# EAGLE design triversity (EAGLE 6.6.0)
Triversity Multipath Erazer
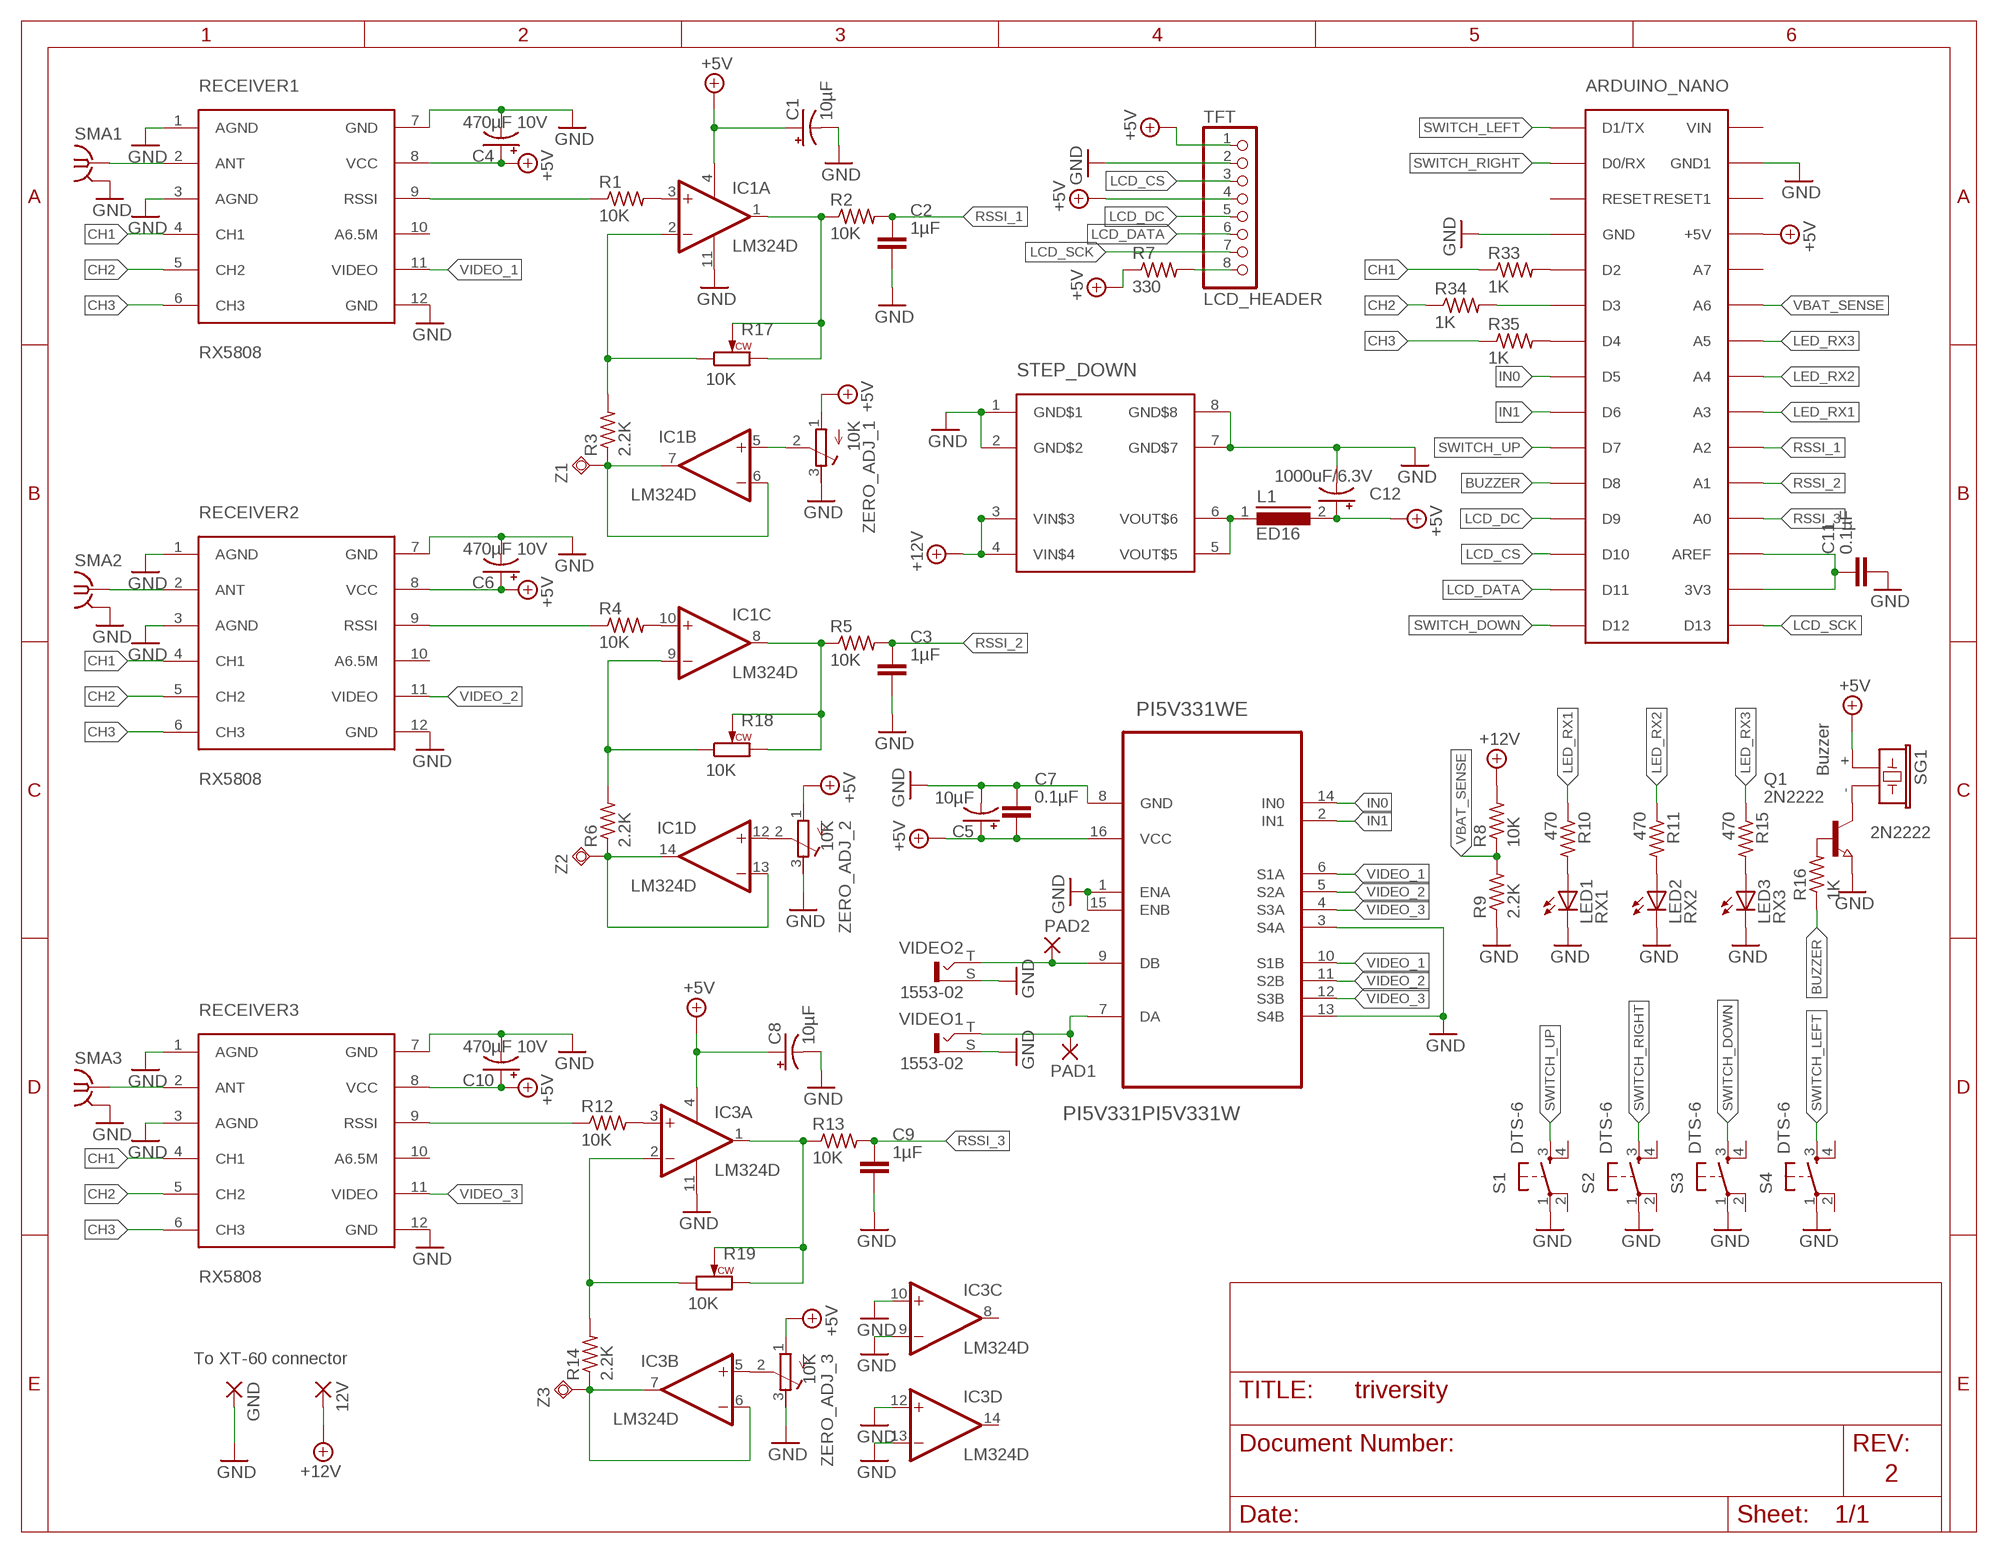
[diagram p0: schematic, sheet 1]

## Parts
12V  WIREPAD4,16O1,6  [4,16O1,6]
ARDUINO_NANO  ARDUINO_NANO  [PDIP-32]
C1  10µF  CAP_POL1206-KIT  [EIA3216-KIT]
C2  1µF  CAPACITOR_NPOL-0805  [C805]
C3  1µF  CAPACITOR_NPOL-0805  [C805]
C4  470µF 10V  CAP_POL7343  [EIA7343]
C5  10µF  CAP_POL1206-KIT  [EIA3216-KIT]
C6  470µF 10V  CAP_POL7343  [EIA7343]
C7  0.1µF  CAPACITOR_NPOL-0805  [C805]
C8  10µF  CAP_POL1206-KIT  [EIA3216-KIT]
C9  1µF  CAPACITOR_NPOL-0805  [C805]
C10  470µF 10V  CAP_POL7343  [EIA7343]
C11  0.1µF  CAPACITOR_NPOL-0805  [C805]
C12  1000uF/6.3V  CPOL-USE5-10.5  [E5-10,5]
GND  WIREPAD4,16O1,6  [4,16O1,6]
IC1  LM324D  [SO14]
IC3  LM324D  [SO14]
L1  ED16  [ED16]
LED1  RX1  LED3MM  [LED3MM]
LED2  RX2  LED3MM  [LED3MM]
LED3  RX3  LED3MM  [LED3MM]
PAD1  WIREPADSMD1,27-254  [SMD1,27-2,54]
PAD2  WIREPADSMD1,27-254  [SMD1,27-2,54]
PI5V331WE  PI5V331PI5V331W  [SO16]
Q1  2N2222  NPN-TRANSISTOR_SOT23  [SOT23]
R1  10K  R-US_M0805  [M0805]
R2  10K  R-US_M0805  [M0805]
R3  2.2K  R-US_M0805  [M0805]
R4  10K  R-US_M0805  [M0805]
R5  10K  R-US_M0805  [M0805]
R6  2.2K  R-US_M0805  [M0805]
R7  330  R-US_M0805  [M0805]
R8  10K  R-US_M0805  [M0805]
R9  2.2K  R-US_M0805  [M0805]
R10  470  R-US_M0805  [M0805]
R11  470  R-US_M0805  [M0805]
R12  10K  R-US_M0805  [M0805]
R13  10K  R-US_M0805  [M0805]
R14  2.2K  R-US_M0805  [M0805]
R15  470  R-US_M0805  [M0805]
R16  1K  R-US_M0805  [M0805]
R17  10K  POT-SINGLE-RK09L  [RK09L-SINGLE]
R18  10K  POT-SINGLE-RK09L  [RK09L-SINGLE]
R19  10K  POT-SINGLE-RK09L  [RK09L-SINGLE]
R33  1K  R-US_M0805  [M0805]
R34  1K  R-US_M0805  [M0805]
R35  1K  R-US_M0805  [M0805]
RECEIVER1  RX5808  RX5808V1  [RX5808]
RECEIVER2  RX5808  RX5808V1  [RX5808]
RECEIVER3  RX5808  RX5808V1  [RX5808]
S1  DTS-6  [DTS-6]
S2  DTS-6  [DTS-6]
S3  DTS-6  [DTS-6]
S4  DTS-6  [DTS-6]
SG1  Buzzer  F/CM12P  [F/CM12P]
SMA1  SMA-142-0711-821/826  [J502-ND-142-0711-821/826]
SMA2  SMA-142-0711-821/826  [J502-ND-142-0711-821/826]
SMA3  SMA-142-0711-821/826  [J502-ND-142-0711-821/826]
STEP_DOWN  LM2596_MODULE  [LM2596-MODULE]
TFT  LCD_HEADER  PINHD-1X8CLEANBIG  [1X08-CLEANBIG]
VIDEO1  1553-02  [1553-02]
VIDEO2  1553-02  [1553-02]
Z1  TP-M  [KEY-MINIATURE]
Z2  TP-M  [KEY-MINIATURE]
Z3  TP-M  [KEY-MINIATURE]
ZERO_ADJ_1  10K  R-TRIMM3296X  [RTRIM3296X]
ZERO_ADJ_2  10K  R-TRIMM3296X  [RTRIM3296X]
ZERO_ADJ_3  10K  R-TRIMM3296X  [RTRIM3296X]

## Nets
3V3_AREF: ARDUINO_NANO.3V3 ARDUINO_NANO.AREF C11.1
+5V: ARDUINO_NANO.+5V C1.A(+) C4.A(+) C5.A(+) C6.A(+) C7.2 C8.A(+) C10.A(+) C12.+ IC1.4(P:V+) IC3.4(P:V+) L1.2 PI5V331WE.16(VCC) R7.1 RECEIVER1.8(VCC) RECEIVER2.8(VCC) RECEIVER3.8(VCC) SG1.+ TFT.1 TFT.4 ZERO_ADJ_1.1(E) ZERO_ADJ_2.1(E) ZERO_ADJ_3.1(E)
+12V: 12V.1(P) R8.2 STEP_DOWN.3(VIN$3) STEP_DOWN.4(VIN$4)
ANT1: RECEIVER1.2(ANT) SMA1.1
ANT2: RECEIVER2.2(ANT) SMA2.1
ANT3: RECEIVER3.2(ANT) SMA3.1
BUZZER: ARDUINO_NANO.D8 R16.1
CH1: R33.1 RECEIVER1.4(CH1) RECEIVER2.4(CH1) RECEIVER3.4(CH1)
CH2: R34.1 RECEIVER1.5(CH2) RECEIVER2.5(CH2) RECEIVER3.5(CH2)
CH3: R35.1 RECEIVER1.6(CH3) RECEIVER2.6(CH3) RECEIVER3.6(CH3)
GND: ARDUINO_NANO.GND ARDUINO_NANO.GND1 C1.C(-) C2.2 C3.2 C4.C(-) C5.C(-) C6.C(-) C7.1 C8.C(-) C9.2 C10.C(-) C11.2 C12.- GND.1(P) IC1.11(P:V-) IC3.9(C:-IN) IC3.10(C:+IN) IC3.11(P:V-) IC3.12(D:+IN) IC3.13(D:-IN) LED1.K(C) LED2.K(C) LED3.K(C) PI5V331WE.1(ENA) PI5V331WE.3(S4A) PI5V331WE.8(GND) PI5V331WE.13(S4B) PI5V331WE.15(ENB) Q1.2(E) R9.1 RECEIVER1.1(AGND) RECEIVER1.3(AGND) RECEIVER1.7(GND) RECEIVER1.12(GND) RECEIVER2.1(AGND) RECEIVER2.3(AGND) RECEIVER2.7(GND) RECEIVER2.12(GND) RECEIVER3.1(AGND) RECEIVER3.3(AGND) RECEIVER3.7(GND) RECEIVER3.12(GND) S1.1 S2.1 S3.1 S4.1 SMA1.G@1(GND) SMA2.G@1(GND) SMA3.G@1(GND) STEP_DOWN.1(GND$1) STEP_DOWN.2(GND$2) STEP_DOWN.7(GND$7) STEP_DOWN.8(GND$8) TFT.2 VIDEO1.S VIDEO2.S ZERO_ADJ_1.3(A) ZERO_ADJ_2.3(A) ZERO_ADJ_3.3(A)
IN0: ARDUINO_NANO.D5 PI5V331WE.14(IN0)
IN1: ARDUINO_NANO.D6 PI5V331WE.2(IN1)
LCD_CS: ARDUINO_NANO.D10 TFT.3
LCD_DATA: ARDUINO_NANO.D11 TFT.6
LCD_DC: ARDUINO_NANO.D9 TFT.5
LCD_SCK: ARDUINO_NANO.D13 TFT.7
LED_RX1: ARDUINO_NANO.A3 R10.1
LED_RX2: ARDUINO_NANO.A4 R11.1
LED_RX3: ARDUINO_NANO.A5 R15.1
N$1: IC1.3(A:+IN) R1.2
N$2: IC3.3(A:+IN) R12.2
N$3: IC1.1(A:OUT) R2.1 R17.2(W) R17.3(CW)
N$4: R7.2 TFT.8
N$5: IC1.6(B:-IN) IC1.7(B:OUT) R3.1 Z1.P$1(TP)
N$6: IC1.2(A:-IN) R3.2 R17.1(CCW)
N$7: IC1.10(C:+IN) R4.2
N$8: IC1.5(B:+IN) ZERO_ADJ_1.2(S)
N$9: IC1.8(C:OUT) R5.1 R18.2(W) R18.3(CW)
N$10: IC1.13(D:-IN) IC1.14(D:OUT) R6.1 Z2.P$1(TP)
N$11: IC1.9(C:-IN) R6.2 R18.1(CCW)
N$12: IC1.12(D:+IN) ZERO_ADJ_2.2(S)
N$13: Q1.3(C) SG1.-
N$14: IC3.1(A:OUT) R13.1 R19.2(W) R19.3(CW)
N$15: IC3.6(B:-IN) IC3.7(B:OUT) R14.1 Z3.P$1(TP)
N$16: IC3.2(A:-IN) R14.2 R19.1(CCW)
N$17: IC3.5(B:+IN) ZERO_ADJ_3.2(S)
N$18: LED1.A R10.2
N$19: Q1.1(B) R16.2
N$21: L1.1 STEP_DOWN.5(VOUT$5) STEP_DOWN.6(VOUT$6)
N$48: LED2.A R11.2
N$49: LED3.A R15.2
N$50: ARDUINO_NANO.D2 R33.2
N$51: ARDUINO_NANO.D3 R34.2
N$53: ARDUINO_NANO.D4 R35.2
RAW_RSSI1: R1.1 RECEIVER1.9(RSSI)
RAW_RSSI2: R4.1 RECEIVER2.9(RSSI)
RAW_RSSI3: R12.1 RECEIVER3.9(RSSI)
RSSI_1: ARDUINO_NANO.A2 C2.1 R2.2
RSSI_2: ARDUINO_NANO.A1 C3.1 R5.2
RSSI_3: ARDUINO_NANO.A0 C9.1 R13.2
SWITCH_DOWN: ARDUINO_NANO.D12 S3.3
SWITCH_LEFT: ARDUINO_NANO.D1/TX S4.3
SWITCH_RIGHT: ARDUINO_NANO.D0/RX S2.3
SWITCH_UP: ARDUINO_NANO.D7 S1.3
VBAT_SENSE: ARDUINO_NANO.A6 R8.1 R9.2
VIDEO_1: PI5V331WE.6(S1A) PI5V331WE.10(S1B) RECEIVER1.11(VIDEO)
VIDEO_2: PI5V331WE.5(S2A) PI5V331WE.11(S2B) RECEIVER2.11(VIDEO)
VIDEO_3: PI5V331WE.4(S3A) PI5V331WE.12(S3B) RECEIVER3.11(VIDEO)
VIDEO_OUT1: PAD1.1(P) PI5V331WE.7(DA) VIDEO1.T
VIDEO_OUT2: PAD2.1(P) PI5V331WE.9(DB) VIDEO2.T
Unconnected: ARDUINO_NANO.A7 ARDUINO_NANO.RESET ARDUINO_NANO.RESET1 ARDUINO_NANO.VIN IC3.8(C:OUT) IC3.14(D:OUT) RECEIVER1.10(A6.5M) RECEIVER2.10(A6.5M) RECEIVER3.10(A6.5M) S1.2 S1.4 S2.2 S2.4 S3.2 S3.4 S4.2 S4.4

## Notes on the sheet
- 2N2222
- To XT-60 connector
- 2

## Power pins joined to a net without a drawn wire
GND: SMA1.G@2(GND) SMA1.G@3(GND) SMA1.G@4(GND) SMA2.G@2(GND) SMA2.G@3(GND) SMA2.G@4(GND) SMA3.G@2(GND) SMA3.G@3(GND) SMA3.G@4(GND)

## Library data of the parts
12V GND PAD1 PAD2 = wirepad:WIREPAD: Wire PAD connect wire on PCB
ARDUINO_NANO = goebish:ARDUINO_NANO
C1 C4-C6 C8 C10 = SparkFun-Passives:CAP_POL: Capacitor Polarized These are standard SMD and PTH capacitors. Normally 10uF, 47uF, and 100uF in electrolytic and tantalum varieties. Always verify the external diameter of the through hole cap, it varies with capacity, voltage, and manufacturer. The EIA devices should be standard.
C2 C3 C7 C9 C11 = dangerous_prototype_devices:CAPACITOR_NPOL: Non-Polarized capacitor in various packages
C12 = adafruit:CPOL-US: POLARIZED CAPACITOR, American symbol
IC1 IC3 = linear:LM324: OP AMP
L1 = inductors:ED16: INDUCTOR
LED1-LED3 = adafruit:LED: LED OSRAM: - CHIPLED LG R971, LG N971, LY N971, LG Q971, LY Q971, LO R971, LY R971 LH N974, LH R974 LS Q976, LO Q976, LY Q976 LO Q996 - Hyper CHIPLED LW Q18S LB Q993, LB Q99A, LB R99A - SideLED LS A670, LO A670, LY A670, LG A670, LP A670 LB A673, LV A673, LT A673, LW A673 LH A674 LY A675 LS A676, LA A676, LO A676, LY A676, LW A676 LS A679, LY A679, LG A679 - Hyper Micro SIDELED® LS Y876, LA Y876, LO Y876, LY Y876 LT Y87S - SmartLED LW L88C, LW L88S LB L89C, LB L89S, LG L890 LS L89K, LO L89K, LY L89K LS L896, LA L896, LO L896, LY L896 - TOPLED LS T670, LO T670, LY T670, LG T670, LP T670 LSG T670, LSP T670, LSY T670, LOP T670, LYG T670 LG T671, LOG T671, LSG T671 LB T673, LV T673, LT T673, LW T673 LH T674 LS T676, LA T676, LO T676, LY T676, LB T676, LH T676, LSB T676, LW T676 LB T67C, LV T67C, LT T67C, LS T67K, LO T67K, LY T67K, LW E67C LS E67B, LA E67B, LO E67B, LY E67B, LB E67C, LV E67C, LT E67C LW T67C LS T679, LY T679, LG T679 LS T770, LO T770, LY T770, LG T770, LP T770 LB T773, LV T773, LT T773, LW T773 LH T774 LS E675, LA E675, LY E675, LS T675 LS T776, LA T776, LO T776, LY T776, LB T776 LHGB T686 LT T68C, LB T68C - Hyper Mini TOPLED® LB M676 - Mini TOPLED Santana® LG M470 LS M47K, LO M47K, LY M47K Source: http://www.osram.convergy.de/
PI5V331WE = goebish:PI5V331: Bidirectional Dual 4-Channel multiplexer/demultiplexer
Q1 = semicon-smd-ipc:NPN-TRANSISTOR_: NPN TRANSISTOR
R1-R16 R33-R35 = adafruit:R-US_: RESISTOR, American symbol
R17-R19 = f-potentiometers:POT-SINGLE
RECEIVER1-RECEIVER3 = receiver:RX5808
S1-S4 = switch-tact:DTS-6
SG1 = buzzer:F/CM12P: BUZZER Source: Buerklin; OC_FARNELL: unknown; OC_NEWARK: unknown
SMA1-SMA3 = goebish:SMA-: SMA 50 Ohm End Launch Jack Receptacle - Round Contact Johnson Components Source: www.johnsoncomponents.com .. J502-ND.pdf
STEP_DOWN = goebish:LM2596_MODULE: Mini DC-DC Converter Step Down Module 3A
TFT = adafruit:PINHD-1X8: PIN HEADER
VIDEO1 VIDEO2 = goebish:1553-02: RCA connectors Lumberg 1553-02 Cinch RCA-Einbaukupplung nach JEITA RC-5231, abgewinkelte Ausführung Source: http://www.lumberg.com/Produkte/PDFs/1553_02.pdf; MPN: 1553-02; OC_FARNELL: 1200146; OC_NEWARK: 98K2588
Z1-Z3 = smt-test-points:TP-: Surface mount wire loop test point
ZERO_ADJ_1-ZERO_ADJ_3 = resistor:R-TRIMM: Trimm resistor

## Net classes
0 default: width 0.254 mm, drill 0.33 mm, clearance 0.203 mm

## Board
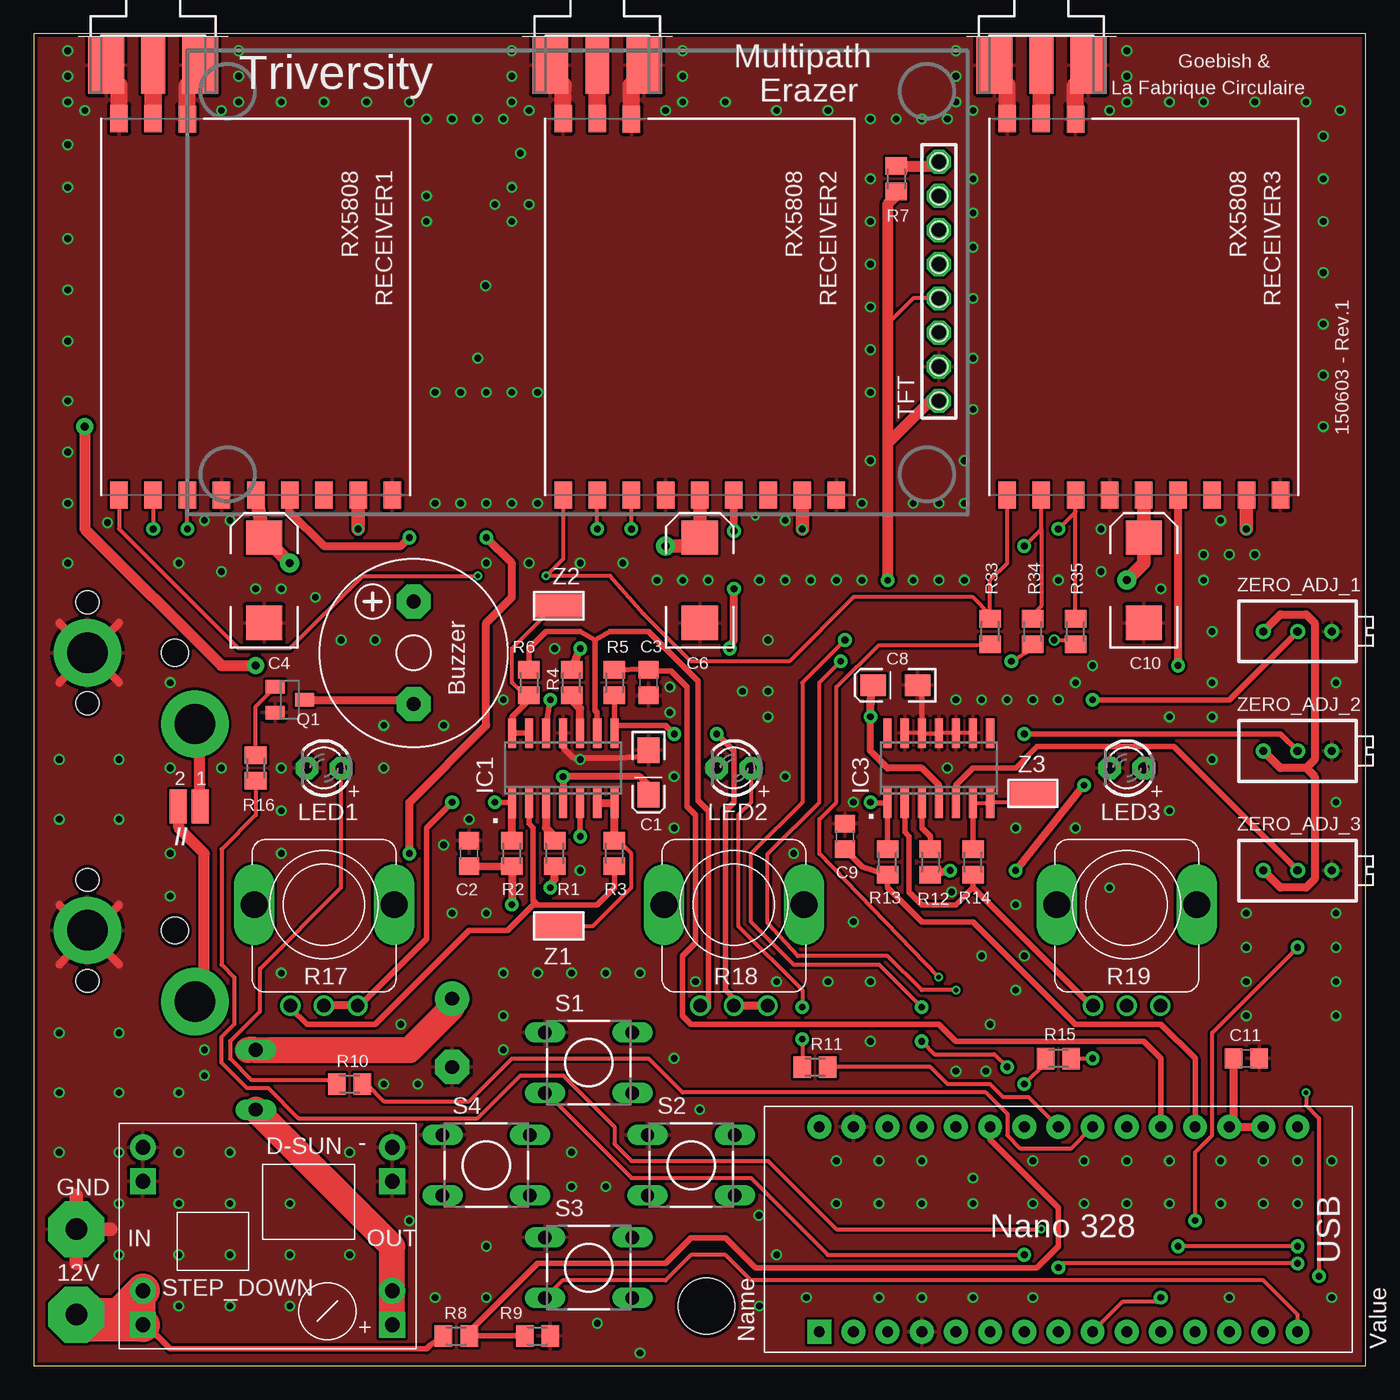
[diagram p1: board, top side]
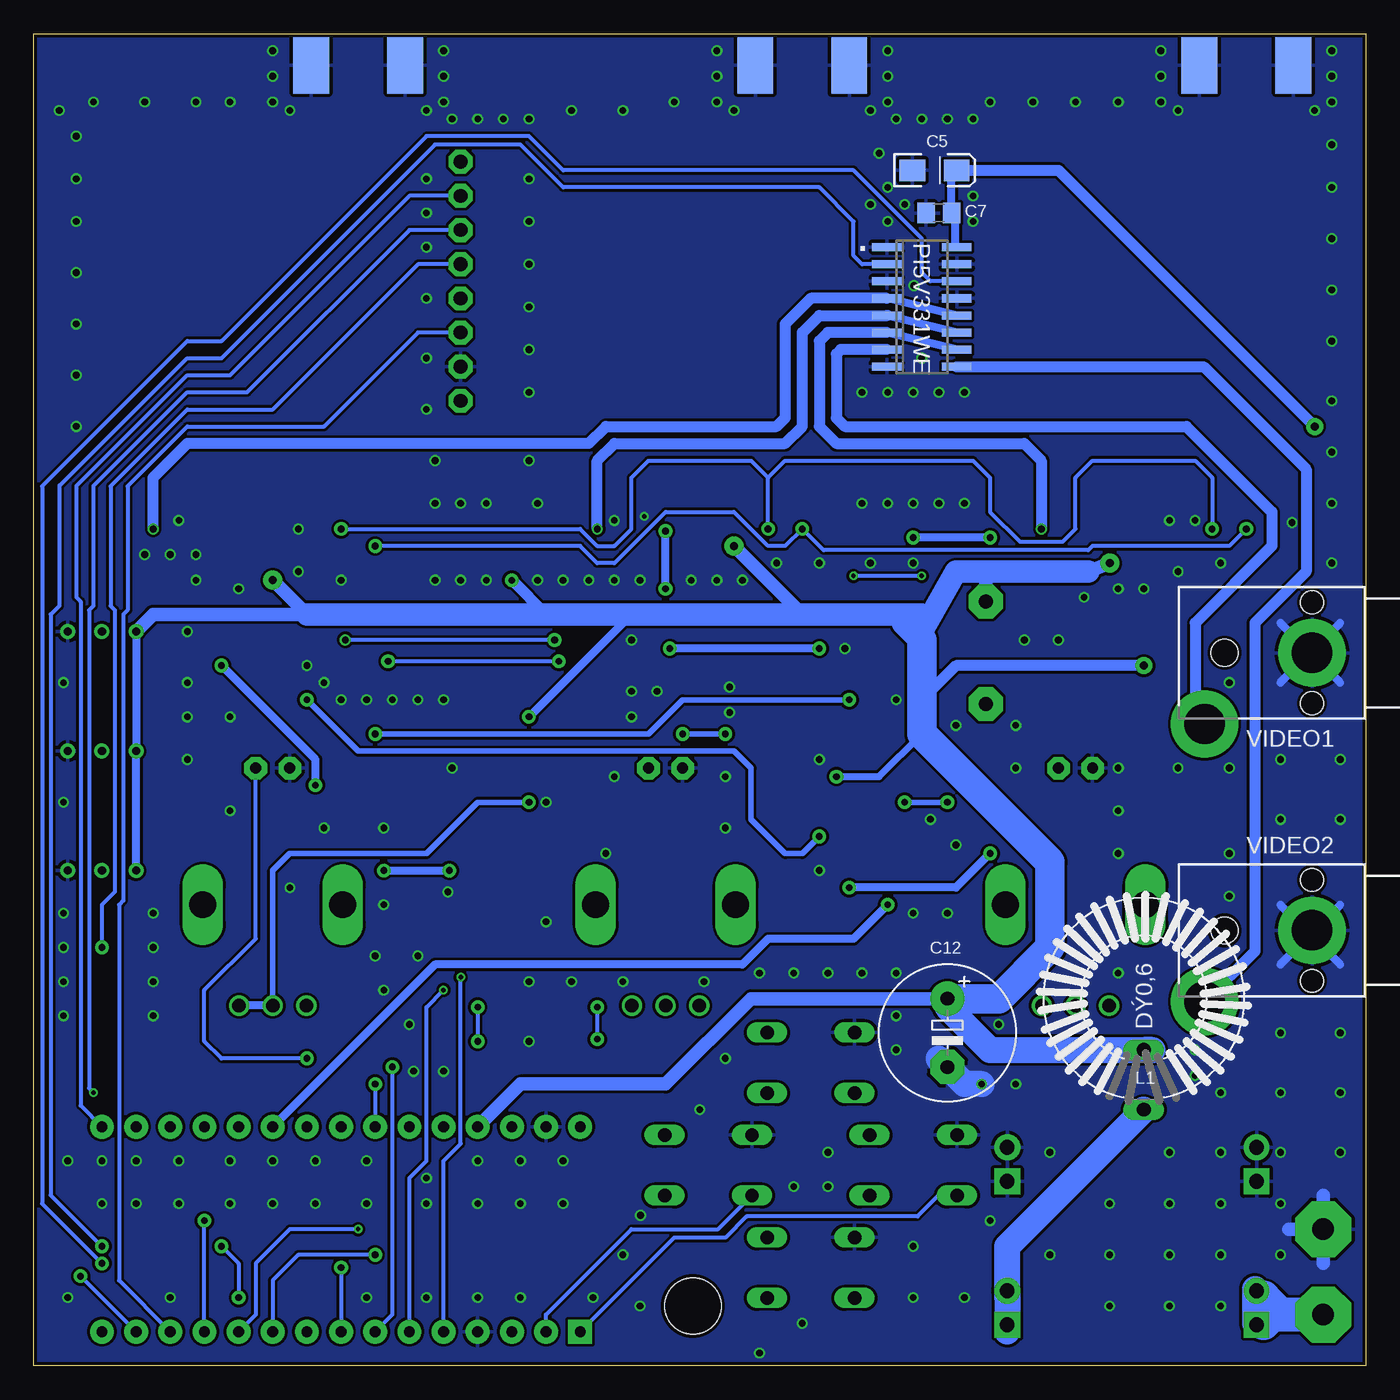
[diagram p2: board, bottom side, seen from below]

Size 99.06 x 99.06 mm. Coordinates in mm from the lower left corner, seen from the top.
Outline: 0,0 99.06,0 99.06,99.06 0,99.06 0,0
Copper layers (1*16): Top 0.035mm / dielectric 1.5mm / Bottom 0.035mm
Design rules "default": minimum track width 5mil, minimum drill 12mil, track to track 5mil, track to pad 5mil, pad to pad 5mil, via to via 5mil, smd to smd 0mil, copper to edge 10mil, drill to drill 10mil, minimum pad ring 10mil, minimum via ring 6mil, stop-mask expansion 2mil, vias tented up to drill 25mil, thermal gap 10mil
Holes 4.2 mm at 50.04,4.45

### Footprints (pad centres in the part's own frame; a part is rotated, then mirrored left to right if it is on the bottom)
4,16O1,6 = drill 1.6 pad 4.166 octagon: 1 0,0
PDIP-32 = drill 0.8 pad 1.778: 3V3 15.24,-35.56; +5V 15.24,-10.16; A0 15.24,-30.48; A1 15.24,-27.94; A2 15.24,-25.4; A3 15.24,-22.86; A4 15.24,-20.32; A5 15.24,-17.78; A6 15.24,-15.24; A7 15.24,-12.7; AREF 15.24,-33.02; D0/RX 0,-5.08; D2 0,-12.7; D3 0,-15.24; D4 0,-17.78; D5 0,-20.32; D6 0,-22.86; D7 0,-25.4; D8 0,-27.94; D9 0,-30.48; D10 0,-33.02; D11 0,-35.56; D12 0,-38.1; D13 15.24,-38.1; GND 0,-10.16; GND1 15.24,-5.08; RESET 0,-7.62; RESET1 15.24,-7.62; VIN 15.24,-2.54 | drill 0.8 pad 1.778 square: D1/TX 0,-2.54
EIA3216-KIT = smd 1.9 x 1.6: A 1.65,0; C -1.65,0
C805 = smd 1.3 x 1.5: 1 -0.95,0; 2 0.95,0
EIA7343 = smd 2.55 x 2.7: A 3.17,0; C -3.17,0
E5-10,5 = drill 1.016 pad 2.54: + -2.54,0 | drill 1.016 pad 2.54 octagon: - 2.54,0
SO14 = smd 0.6 x 2.2: 1 -3.81,-2.6; 2 -2.54,-2.6; 3 -1.27,-2.6; 4 0,-2.6; 5 1.27,-2.6; 6 2.54,-2.6; 7 3.81,-2.6; 8 3.81,2.6; 9 2.54,2.6; 10 1.27,2.6; 11 0,2.6; 12 -1.27,2.6; 13 -2.54,2.6; 14 -3.81,2.6
ED16 = drill 1.016 long: 1 -8.255,0; 2 -3.81,0
LED3MM = drill 0.813 pad 1.676 octagon: A -1.27,0; K 1.27,0
SMD1,27-2,54 = smd 1.27 x 2.54: 1 0,0
SO16 = smd 0.6 x 2.2: 1 -4.445,-2.6; 2 -3.175,-2.6; 3 -1.905,-2.6; 4 -0.635,-2.6; 5 0.635,-2.6; 6 1.905,-2.6; 7 3.175,-2.6; 8 4.445,-2.6; 9 4.445,2.6; 10 3.175,2.6; 11 1.905,2.6; 12 0.635,2.6; 13 -0.635,2.6; 14 -1.905,2.6; 15 -3.175,2.6; 16 -4.445,2.6
SOT23 = smd 1 x 1.4: 1 -0.95,-1.1; 2 0.95,-1.1; 3 0,1.1
M0805 = smd 1.3 x 1.6: 1 -0.95,0; 2 0.95,0
RK09L-SINGLE = drill 1: 1 -2.5,-7.5; 2 0,-7.5; 3 2.5,-7.5 | drill 2 long: S1 -5.2,0; S2 5.2,0
RX5808 = smd 2 x 1.3: 1 -13.97,-5.08; 2 -14,-7.62; 3 -14,-10.16; 4 14,-10.16; 5 14,-7.62; 6 14,-5.08; 7 14,-2.54; 8 14,0; 9 14,2.54; 10 14,5.08; 11 14,7.62; 12 14,10.16
DTS-6 = drill 1 long: 1 -3.25,2.25; 2 3.25,2.25; 3 -3.25,-2.25; 4 3.25,-2.25
F/CM12P = drill 1.016 pad 2.54 octagon: + 3.81,0; - -3.81,0
J502-ND-142-0711-821/826 = smd 4.191 x 1.778: 1 2.115,0 | smd 4.191 x 2.667: G@1 2.115,3.495; G@2 2.115,-3.495 | smd 4.191 x 2.667 bottom: G@3 2.115,3.495; G@4 2.115,-3.495
LM2596-MODULE = drill 1.1 pad 1.93: 1 1.778,14.986; 3 1.778,4.318; 6 20.32,4.318; 8 20.32,14.986 | drill 1.1 pad 1.93 square: 2 1.778,12.446; 4 1.778,1.778; 5 20.32,1.778; 7 20.32,12.446
1X08-CLEANBIG = drill 1.016 pad 1.778 octagon: 1 -8.89,0; 2 -6.35,0; 3 -3.81,0; 4 -1.27,0; 5 1.27,0; 6 3.81,0; 7 6.35,0; 8 8.89,0
1553-02 = drill 3 pad 5: S 0,-4; T 5.3,-12 | hole 1.7: -3.75,-4; 3.75,-4 | hole 2: 0,-10.5
KEY-MINIATURE = smd 3.429 x 1.778: P$1 0,0
RTRIM3296X = drill 0.61: 1 0,-2.54; 2 0,0; 3 0,2.54

### Placement (x,y rotation side)
12V  3.17,3.81 0 top
ARDUINO_NANO  55.88,2.54 90 top
C1  45.72,44.13 270 top
C2  32.38,38.1 90 top
C3  45.72,50.8 270 top
C4  17.14,58.42 90 top
C5  32.07,88.9 0 bottom
C6  49.53,58.42 90 top
C7  31.75,85.72 0 bottom
C8  64.07,50.61 180 top
C9  60.33,39.37 90 top
C10  82.55,58.42 90 top
C11  90.17,22.86 0 top
C12  31.11,24.77 270 bottom
GND  3.17,10.16 0 top
IC1  39.37,44.45 0 top
IC3  67.31,44.45 0 top
L1  16.51,27.3 90 bottom
LED1  21.59,44.45 180 top
LED2  52.07,44.45 180 top
LED3  81.28,44.45 180 top
PAD1  12.37,41.59 0 top
PAD2  10.74,41.61 0 top
PI5V331WE  33.02,78.74 270 bottom
Q1  19.05,49.53 270 top
R1  38.73,38.1 90 top
R2  35.56,38.1 270 top
R3  43.18,38.1 270 top
R4  40.01,50.8 270 top
R5  43.18,50.8 90 top
R6  36.83,50.8 90 top
R7  64.14,88.27 90 top
R8  31.43,2.22 180 top
R9  37.47,2.22 180 top
R10  23.5,20.95 180 top
R11  58.1,22.23 180 top
R12  66.67,37.47 90 top
R13  63.5,37.47 270 top
R14  69.85,37.47 270 top
R15  76.2,22.86 0 top
R16  16.51,44.45 90 top
R17  21.59,34.29 0 top
R18  52.07,34.29 0 top
R19  81.28,34.29 0 top
R33  71.12,54.61 270 top
R34  74.3,54.61 270 top
R35  77.47,54.61 270 top
RECEIVER1  16.51,78.74 270 top
RECEIVER2  49.53,78.74 270 top
RECEIVER3  82.55,78.74 270 top
S1  41.27,22.54 0 top
S2  48.9,14.92 0 top
S3  41.27,7.3 0 top
S4  33.66,14.92 0 top
SG1  28.26,53.02 90 top
SMA1  8.89,98.82 270 top
SMA2  41.91,98.82 270 top
SMA3  74.93,98.82 270 top
STEP_DOWN  6.35,1.27 0 top
TFT  67.31,80.64 90 top
U$1  [ST7735-SPI]  11.43,97.79 270 top
VIDEO1  0,53.02 270 bottom
VIDEO2  0,32.38 270 bottom
Z1  39.05,32.7 0 top
Z2  39.05,56.52 0 top
Z3  74.3,42.55 0 top
ZERO_ADJ_1  93.98,54.61 270 top
ZERO_ADJ_2  93.98,45.72 270 top
ZERO_ADJ_3  93.98,36.83 270 top

### Tracks (layer width: path | path; a pad name or v marks a point on that pad's centre or on a via)
3V3_AREF
  Top 0.305: 89.22,17.78 ARDUINO_NANO.AREF
  Top 0.61: ARDUINO_NANO.AREF ARDUINO_NANO.3V3 | C11.1 89.22,17.78
+5V  (via drill 0.5 pad 1.02, 0.6 pad 1.27, 0.6 pad 1.42)
  Top 0.305: TFT.4 65.41,79.38 63.5,77.47
  Top 0.406: C6.A 49.53,60.96
  Top 0.508: IC3.4 67.31,43.18 66.04,44.45 63.5,44.45 62.23,45.72 v62.23,48.26 | 45.72,43.18 45.09,43.81 v39.37,43.81 IC1.4
  Top 0.61: C8.A 62.23,49.25 v62.23,48.26 | C1.A 45.72,43.18 | ZERO_ADJ_1.1 92.71,55.88 94.61,55.88 95.25,55.24 95.25,45.09 94.61,44.45 | 94.61,44.45 92.71,44.45 ZERO_ADJ_2.1 | 94.61,44.45 95.25,43.81 95.25,36.2 94.61,35.56 92.71,35.56 ZERO_ADJ_3.1
  Top 0.813: TFT.1 66.67,71.75 63.5,68.58 | 63.5,68.58 v63.5,58.42 | R7.1 64.14,87 63.5,86.36 63.5,77.47 63.5,68.58 | v3.81,69.85 3.81,62.23 13.97,52.07 v16.51,52.07
  Top 1.016: v19.05,59.69 17.78,60.96 | C4.A RECEIVER1.8 | v46.99,60.96 49.53,60.96 | C6.A RECEIVER2.8 | RECEIVER3.8 C10.A 82.55,59.69 v81.28,58.42
  Top 1.27: 82.78,60.96 C10.A 82.55,60.96 | 17.78,60.96 16.74,62.23 | RECEIVER2.8 49.53,64.77
  Top 1.422: 16.74,62.23 C4.A
  Top 1.93: C12.+ 31.11,26.67 27.94,23.5 L1.2 15.95,23.5
  Bottom 0.305: 33.02,53.98 33.02,50.8 32.38,50.16 | 30.53,85.46 C7.2 | 30.8,88.52 C5.A
  Bottom 0.406: 30.53,83.3 PI5V331WE.16 | 30.48,59.05 28.57,59.05 28.26,58.74
  Bottom 0.508: v39.37,43.81 36.2,43.81 33.02,46.99
  Bottom 0.61: 54.61,55.88 v62.23,48.26 | ZERO_ADJ_3.1 ZERO_ADJ_2.1 ZERO_ADJ_1.1 | 30.53,83.3 30.53,85.46 | C7.2 30.8,88.52
  Bottom 0.813: C5.A 22.86,88.9 v3.81,69.85 | v63.5,58.42 60.96,55.88 | v16.51,52.07 30.48,52.07 32.38,50.16
  Bottom 1.016: 20.64,59.05 v19.05,59.69 | 41.91,55.88 v46.99,60.96 | v81.28,58.42 78.74,55.88 90.17,55.88 ZERO_ADJ_1.1 | C12.+ 45.72,27.3 52.07,20.95 62.87,20.95 ARDUINO_NANO.+5V | SG1.+ 28.26,58.74
  Bottom 1.676: 20.64,59.05 30.48,59.05 33.02,54.61 33.02,55.88 41.91,55.88 54.61,55.88 60.96,55.88 78.74,55.88
  Bottom 1.93: 33.02,54.61 33.02,53.98 33.66,54.61 | C12.+ 31.11,26.67 27.94,23.5 L1.2 15.88,23.5 | 33.66,54.61 34.29,55.24 33.66,55.24 33.66,54.61
  Bottom 2.184: 33.02,53.98 33.02,46.99 23.5,37.47 23.5,31.11 27.3,27.3 C12.+
+12V
  Top 0.305: STEP_DOWN.4 8.38,3.05
  Top 0.406: 8.38,3.05 10.16,1.27 29.21,1.27 29.53,1.59 R8.2
  Top 1.676: 3.3,3.05 12V.1
  Top 1.93: STEP_DOWN.4 STEP_DOWN.3 8.26,5.71
  Top 2.54: STEP_DOWN.4 3.3,3.05 | 12V.1 6.35,3.81 STEP_DOWN.3
  Bottom 0.61: 7.62,5.08 STEP_DOWN.3 8.26,5.71
  Bottom 1.93: 8.26,5.71 8.26,3.17
  Bottom 2.54: 7.62,5.08 6.35,3.81 12V.1 6.99,3.81 7.62,3.17
ANT1
  Top 1.27: RECEIVER1.2 8.89,92.71
  Top 1.308: RECEIVER1.2 SMA1.1
ANT2
  Top 1.308: RECEIVER2.2 SMA2.1
ANT3
  Top 1.308: RECEIVER3.2 SMA3.1
BUZZER  (via drill 0.33)
  Top 0.305: v74.93,10.16 59.69,10.16 54.61,15.24 44.45,15.24 43.18,16.51 43.18,17.78 39.37,21.59 36.2,21.59 33.02,18.41 19.68,18.41 17.46,20.64 15.88,20.64 13.97,22.54 13.97,24.45 14.92,25.4 14.92,28.89 13.97,29.84 13.97,38.42 16.51,40.96 R16.1
  Bottom 0.305: ARDUINO_NANO.D8 82.55,3.81 82.55,7.62 80.01,10.16 v74.93,10.16
CH1  (via drill 0.33)
  Top 0.305: RECEIVER3.4 72.39,59.69 71.12,58.42 71.12,55.88 | v33.02,58.74 24.45,58.74 19.05,53.34 15.24,53.34 6.35,62.23 RECEIVER1.4 | 71.12,55.88 69.85,57.15 60.96,57.15 56.2,52.39 48.9,52.39 45.4,55.88 42.86,58.74 v38.1,58.74 39.37,60.01 RECEIVER2.4 | 71.12,55.88 R33.1
  Top 0.406: 39.37,64.77 RECEIVER2.4
  Bottom 0.305: v33.02,58.74 v38.1,58.74
CH2  (via drill 0.5 pad 1.02)
  Top 0.305: 74.93,62.23 RECEIVER3.5 74.93,64.77 | RECEIVER1.5 v8.89,62.23 | v41.91,62.23 RECEIVER2.5 | v73.66,60.96 74.93,62.23 | 74.93,62.23 74.93,56.52 74.3,55.88 R34.1
  Top 0.406: 41.91,64.77 RECEIVER2.5
  Bottom 0.305: v8.89,62.23 10.16,60.96 20.32,60.96 20.64,60.64 40.32,60.64 v41.91,62.23 43.18,60.96 44.45,60.96 46.99,63.5 52.07,63.5 55.88,59.69 57.15,59.69 58.42,60.96 v73.66,60.96
CH3  (via drill 0.5 pad 1.02)
  Top 0.305: R35.1 77.47,63.5 | 77.47,63.5 RECEIVER3.6 | 11.43,63.5 RECEIVER1.6 v11.43,62.23 | 77.47,63.5 v76.2,62.23 | v44.45,62.23 RECEIVER2.6
  Bottom 0.305: v76.2,62.23 58.42,62.23 57.15,60.96 55.88,60.96 54.61,62.23 54.61,66.04 53.34,67.31 45.72,67.31 44.45,66.04 | v11.43,62.23 11.43,66.04 12.7,67.31 20.32,67.31 21.59,66.04 21.59,62.23 22.54,61.28 25.72,61.28 27.94,63.5 27.94,66.04 29.21,67.31 43.18,67.31 44.45,66.04 | v44.45,62.23 44.45,66.04
GND  (via drill 0.33, 0.5)
  Top 0.305: IC3.9 IC3.10 IC3.11 67.31,46.99 66.04,46.99 IC3.12 IC3.13 | C8.C 66.04,50.04 | 66.04,50.06 C8.C | C1.C 45.44,45.31 | 39.37,45.97 IC1.11 | 66.04,50.29 C8.C
  Top 0.406: 66.04,50.04 IC3.12 | 45.44,45.31 43.43,45.21 40.13,45.21 39.37,45.97
  Top 0.61: 6.35,29.84 1.91,34.29 | 6.35,34.29 1.91,29.84 | 6.35,50.8 1.91,55.24 | 1.91,50.8 6.35,55.24
  Top 0.813: RECEIVER1.12 26.67,64.14
  Top 1.016: 3.17,7.62 GND.1 | GND.1 3.17,12.7 | GND.1 5.71,10.16
  Top 1.27: RECEIVER1.3 6.35,95.25 | RECEIVER1.1 11.43,95.25 | RECEIVER2.3 39.37,95.25 | RECEIVER2.1 44.45,95.25 | RECEIVER3.3 72.39,95.25 | RECEIVER3.1 77.47,95.25
  Bottom 0.61: 6.35,50.8 1.91,55.24 | 6.35,29.84 1.91,34.29 | 6.35,34.29 1.91,29.84 | 1.91,50.8 6.35,55.24
  Bottom 1.016: 3.17,7.62 GND.1 | GND.1 3.17,12.7 | GND.1 5.71,10.16
  Bottom 1.93: v28.57,20.95 29.84,20.95 31.75,22.86
  other vias: 35.56,87.63 34.29,86.36 35.56,85.09 36.83,86.36 29.21,85.09 35.56,72.39 33.66,72.39 31.75,72.39 29.84,72.39 35.56,64.14 33.66,64.14 31.75,64.14 29.84,64.14 61.59,64.14 65.41,64.14 67.31,64.14 69.22,64.14 90.81,60.33 88.9,60.33 87,60.33 87,58.42 83.82,57.78 46.35,58.42 48.26,58.42 50.16,58.42 52.7,50.16 54.61,50.16 54.61,48.26 69.22,58.42 67.31,58.42 65.41,58.42 61.59,58.42 59.69,58.42 57.78,58.42 55.88,58.42 53.98,58.42 62.23,72.39 62.23,75.56 62.23,78.74 62.23,81.92 62.23,85.09 68.58,97.79 68.58,95.89 68.58,93.98 69.85,93.34 80.01,93.34 81.28,93.98 81.28,95.89 81.28,97.79 35.56,97.79 35.56,95.89 35.56,93.98 36.83,93.34 46.99,93.34 48.26,93.98 48.26,95.89 48.26,97.79 2.54,97.79 2.54,95.89 2.54,93.98 3.81,93.34 13.97,93.34 15.24,93.98 15.24,95.89 15.24,97.79 18.41,57.78 16.51,57.78 13.97,59.05 60.96,41.91 67.94,44.45 70.48,49.53 72.39,49.53 68.58,49.53 74.3,49.53 76.2,49.53 77.47,50.8 78.74,52.07 22.86,53.98 25.4,53.98 30.48,47.62 26.04,47.62 26.04,44.45 47.62,40.01 47.62,43.81 47.31,48.58 34.92,49.53 38.73,53.34 12.7,23.5 12.7,21.59 10.79,20.32 34.92,26.04 34.92,23.5 34.92,29.21 37.47,29.21 40.01,29.21 42.55,29.21 45.09,29.21 31.11,33.66 30.48,38.73 32.38,40.64 90.17,26.04 90.17,28.57 90.17,31.11 90.17,33.66 96.84,26.04 96.84,28.57 96.84,31.11 96.84,33.66 1.91,45.09 6.35,45.09 6.35,40.64 1.91,40.64 59.69,15.24 62.87,15.24 62.87,12.06 59.69,12.06 66.04,12.06 66.04,15.24 66.04,5.08 62.87,5.08 57.47,5.08 53.98,4.45 45.09,0.95 41.91,3.17 69.85,5.08 69.85,12.06 69.85,13.97 74.3,5.08 74.3,12.06 74.3,15.24 78.11,15.24 81.28,15.24 84.45,15.24 84.45,12.06 81.28,12.06 78.11,12.06 88.27,12.06 88.9,5.08 91.44,15.24 93.98,15.24 77.47,40.01 84.45,41.27 87.63,48.26 87.63,54.61 1.91,24.77 6.35,24.77 6.35,20.32 1.91,20.32 1.91,15.88 6.35,15.88 10.79,15.88 14.61,15.88 10.79,12.06 14.61,12.06 14.61,8.26 10.79,8.26 10.79,4.45 14.61,4.45 23.5,15.88 23.5,8.26 19.05,8.26 19.05,12.06 19.05,4.45 27.94,10.79 29.84,5.08 33.66,8.89 40.01,13.34 42.55,13.34 40.01,15.88 49.53,19.05 59.05,28.57 62.23,28.57 62.23,24.13 47.62,22.86 69.22,67.31 69.85,71.12 69.85,74.93 69.85,79.38 69.85,83.19 69.85,85.72 69.85,88.27 29.21,92.71 31.11,92.71 33.02,92.71 34.92,92.71 62.23,92.71 64.14,92.71 66.04,92.71 67.94,92.71 37.47,72.39 43.81,59.69 40.64,59.69 36.83,59.69 33.66,59.69 12.7,62.87 14.61,62.87 26.04,20.95 27.3,25.4 18.41,41.27 18.41,38.1 18.41,29.21 96.52,5.08 96.52,15.24 56.52,38.1 60.96,33.02 70.48,30.48 71.12,25.4 73.03,27.94 73.03,34.29 80.01,35.56 2.54,90.81 2.54,87.63 2.54,83.82 2.54,80.01 2.54,76.2 2.54,71.75 18.41,93.98 21.59,93.98 24.77,93.98 27.94,93.98 51.44,93.98 55.24,93.34 59.05,93.34 84.45,93.98 87,93.98 90.81,93.98 94.61,93.98 97.16,93.34 36.2,90.17 29.21,87 33.6,80.31 2.54,67.94 2.54,64.14 2.54,59.69 55.88,62.87 79.38,62.23 79.38,59.05 88.27,62.87 55.24,8.26 53.94,11.2 96.84,41.91 96.84,50.8 87.63,45.09 84.45,48.26 87.63,50.8 5.49,62.71 95.89,91.44 95.89,88.27 95.89,85.09 95.89,81.28 95.89,77.47 95.89,73.66 95.89,69.85 33.02,74.93 6.35,12.06 6.35,8.26 33.66,5.08 10.16,38.1 10.16,34.92 10.16,50.8 70.8,21.91 68.58,21.91 37.47,64.14 55.88,43.81 73.66,30.48 68.26,35.24 54.61,53.98 62.23,88.27 62.23,67.31 33.66,33.66 18.41,44.45 13.97,44.45 10.16,44.45 53.66,63.18 47.31,50.48 73.03,40.01 40.64,45.09 40.64,36.83 55.24,28.57 49.21,28.57 76.2,58.42 10.79,59.69 20.95,57.15 93.98,12.06 91.44,12.06 88.27,15.24
  pour Top: 0,0 0,99.06 99.06,99.06 99.06,0
  pour Bottom: 0,0 0,99.06 99.06,99.06 99.06,0
IN0  (via drill 0.5 pad 1.02)
  Top 0.305: v93.98,7.62 76.52,7.62 v76.2,7.3
  Bottom 0.305: PI5V331WE.14 32.38,80.64 33.02,81.28 33.02,83.82 38.1,88.9 59.69,88.9 62.23,91.44 69.85,91.44 85.09,76.2 87.63,76.2 98.42,65.41 98.42,12.06 v93.98,7.62 | v76.2,7.3 ARDUINO_NANO.D5
IN1  (via drill 0.5 pad 1.02)
  Top 0.305: v93.98,8.89 v85.09,8.89 | v83.82,5.08 83.5,4.76 80.96,4.76 ARDUINO_NANO.D6
  Bottom 0.305: PI5V331WE.2 37.47,81.92 38.1,82.55 38.1,85.09 40.64,87.63 59.69,87.63 62.87,90.81 69.22,90.81 85.09,74.93 87.63,74.93 97.1,65.46 97.16,65.46 97.16,56.52 97.79,55.88 97.79,12.7 v93.98,8.89 | v85.09,8.89 83.82,7.62 v83.82,5.08
LCD_CS
  Bottom 0.305: TFT.3 70.48,76.83 77.47,69.85 87.63,69.85 92.08,65.41 92.08,56.2 92.39,55.88 92.39,34.61 92.71,34.29 92.71,6.35 ARDUINO_NANO.D10
LCD_DATA  (via drill 0.33, 0.5 pad 1.02)
  Top 0.305: v94.61,20.32 94.61,19.37 95.57,18.41 v95.57,6.67
  Bottom 0.305: TFT.6 71.12,84.45 83.19,72.39 87.63,72.39 94.61,65.41 94.61,56.52 94.93,56.2 94.93,20.64 v94.61,20.32 | v95.57,6.67 ARDUINO_NANO.D11
LCD_DC  (via drill 0.5 pad 1.02)
  Top 0.305: v86.36,10.79 86.36,15.88 87.63,17.14 87.63,24.77 v93.98,31.11
  Bottom 0.305: TFT.5 70.48,81.92 81.28,71.12 87.63,71.12 93.34,65.41 93.34,56.52 93.03,56.2 93.03,35.24 93.98,34.29 v93.98,31.11 | ARDUINO_NANO.D9 v86.36,10.79
LCD_SCK
  Bottom 0.305: TFT.7 71.12,87 84.45,73.66 87.63,73.66 95.89,65.41 95.89,57.15 95.57,56.83 95.57,19.37 ARDUINO_NANO.D13
LED_RX1
  Top 0.305: R10.1 24.77,20.95 26.04,19.68 32.38,19.68 35.56,22.86 45.72,22.86 48.26,20.32 70.8,20.32 72.39,18.73 72.39,17.14 73.34,16.19 77.15,16.19 ARDUINO_NANO.A3
LED_RX2
  Top 0.305: R11.1 66.67,22.23 67.94,20.95 71.12,20.95 72.07,20 73.98,20 ARDUINO_NANO.A4
LED_RX3  (via drill 0.5 pad 1.02)
  Top 0.305: R15.1 75.25,22.55 v73.66,20.95
  Bottom 0.305: v73.66,20.95 ARDUINO_NANO.A5
N$1
  Top 0.61: IC1.3 38.1,40.01 38.73,39.37 R1.2
N$2
  Top 0.406: IC3.3 66.04,40.01 66.67,39.37 R12.2
N$3  (via drill 0.5 pad 1.02)
  Top 0.305: 35.5,41.91 IC1.1 | R17.3 24.09,26.71 24.13,26.67
  Top 0.406: v31.11,41.91 29.21,40.01 29.21,31.75 24.13,26.67 | 35.5,41.91 v34.29,41.91
  Top 0.61: R2.1 IC1.1 | R17.3 R17.2
  Bottom 0.406: v34.29,41.91 v31.11,41.91
N$4
  Top 0.61: 66.98,89.2 TFT.8
  Top 0.813: R7.2 66.98,89.2
N$5
  Top 0.305: R3.1 43.18,39.37 44.45,38.1 44.45,35.56 41.59,32.7 Z1.P$1
  Top 0.61: IC1.6 IC1.7 43.18,39.37
N$6
  Top 0.305: R17.1 19.09,26.63
  Top 0.406: 37.47,34.29 37.15,34.29 35.24,32.38 32.38,32.38 25.4,25.4 20.32,25.4 19.09,26.63 | 37.47,34.29 41.91,34.29 43.18,35.56 R3.2 | IC1.2 36.83,40.32 37.15,40.01 37.15,34.61 37.47,34.29
N$7
  Top 0.61: IC1.10 40.64,48.9 40.01,49.53 R4.2
N$8  (via drill 0.5 pad 1.02)
  Top 0.406: v40.64,39.37 IC1.5 | v78.74,49.53 88.9,49.53 ZERO_ADJ_1.2
  Bottom 0.406: v78.74,49.53 74.93,45.72 46.99,45.72 45.72,44.45 45.72,40.64 43.18,38.1 41.91,38.1 v40.64,39.37
N$9  (via drill 0.5 pad 1.02)
  Top 0.406: 43.18,47.62 IC1.8 43.18,46.99 | 43.18,47.62 R5.1 | v50.8,46.99 52.07,45.72 52.07,41.91 51.44,41.27 51.44,27.94 52.07,27.3 R18.2 | v47.62,46.99 46.99,47.62 43.18,47.62
  Top 0.61: R18.2 R18.3
  Bottom 0.406: v47.62,46.99 v50.8,46.99
N$10
  Top 0.305: R6.1 36.83,49.53 35.56,50.8 35.56,53.34 38.73,56.52 Z2.P$1
  Top 0.406: IC1.13 IC1.14 35.56,48.26 36.83,49.53
N$11
  Top 0.305: IC1.9 41.91,46.99 | R18.1 49.57,26.71 49.53,26.67
  Top 0.406: 41.75,53.98 42.86,54.61 45.72,54.61 49.41,50.92 49.41,42.03 50.16,41.27 50.16,26.67 49.53,26.67 | 41.75,53.98 40.64,54.61 38.1,54.61 36.83,53.34 R6.2 | IC1.9 41.91,48.58 41.75,48.74 41.75,53.98
N$12  (via drill 0.5 pad 1.02)
  Top 0.305: 38.1,47.62 IC1.12
  Top 0.406: ZERO_ADJ_2.2 92.71,46.99 v73.66,46.99 | v38.42,49.53 38.1,47.62 | IC1.12 38.1,46.99
  Bottom 0.406: v73.66,46.99 53.34,46.99 50.8,49.53 v38.42,49.53
N$13
  Top 0.61: Q1.3 27.94,49.53 SG1.-
N$14  (via drill 0.5 pad 1.02)
  Top 0.305: 62.29,41.85 v62.23,41.91
  Top 0.406: R13.1 IC3.1 62.29,41.85
  Bottom 0.406: v62.23,41.91 66.04,41.91 69.85,38.1 80.01,38.1 81.28,36.83 R19.2
  Bottom 0.61: R19.2 R19.3
N$15
  Top 0.305: IC3.6 IC3.7 71.18,41.91 73.66,41.91 Z3.P$1 74.93,43.18
  Top 0.406: R14.1 IC3.6
N$16
  Top 0.305: 78.12,27.29 78.28,27.29 R19.1
  Top 0.406: 69.85,35.56 68.58,34.29 66.04,34.29 65.09,35.24 65.09,39.37 64.77,39.69 IC3.2 | 69.85,35.56 R14.2 | 78.12,27.29 69.85,35.56
N$17
  Top 0.406: IC3.5 68.58,43.18 69.85,44.45 73.03,44.45 74.61,46.04 84.77,46.04 ZERO_ADJ_3.2
N$18
  Top 0.305: LED1.A 22.86,35.56 16.83,29.53 16.83,26.35 14.61,24.13 14.61,22.86 16.19,21.27 22.23,21.27 R10.2
N$19
  Top 0.305: R16.2 16.51,49.04 Q1.1
N$21
  Top 1.93: STEP_DOWN.5 26.67,8.89 L1.1
  Bottom 1.676: STEP_DOWN.5 26.67,5.08
  Bottom 1.93: STEP_DOWN.6 26.67,8.89 L1.1 | 26.67,5.08 STEP_DOWN.6 | STEP_DOWN.6 26.67,2.54
N$48  (via drill 0.5 pad 1.02)
  Top 0.305: LED2.A 53.34,41.91 52.39,40.96 52.39,32.7 57.15,27.94 v57.15,26.67 | v57.15,24.29 R11.2
  Bottom 0.305: v57.15,26.67 v57.15,24.29
N$49  (via drill 0.5 pad 1.02)
  Top 0.305: R15.2 v78.74,22.86
  Bottom 0.305: v78.74,22.86 85.09,22.86 86.36,24.13 86.36,27.94 82.55,31.75 LED3.A
N$50  (via drill 0.33)
  Top 0.305: v67.31,28.89 58.42,38.1 58.42,40.64 59.69,41.91 59.69,50.48 62.87,53.59 70.12,53.59 R33.2
  Bottom 0.305: ARDUINO_NANO.D2 68.58,15.24 67.31,16.51 v67.31,28.89
N$51  (via drill 0.33, 0.5 pad 1.02)
  Top 0.305: v68.58,27.94 66.04,27.94 63.5,30.48 56.83,30.48 54.58,32.94 54.58,38.07 58.42,41.91 58.42,50.8 v60.01,52.39 | v72.71,52.39 74.3,53.34 R34.2
  Bottom 0.305: ARDUINO_NANO.D3 71.12,13.97 69.85,15.24 69.85,26.67 v68.58,27.94 | v60.01,52.39 v72.71,52.39
N$53  (via drill 0.5 pad 0.81, 0.5 pad 1.02)
  Top 0.305: R35.2 77.47,53.34 | v60.33,53.98 57.15,50.8 57.15,41.91 53.34,38.1 53.34,33.02 56.52,29.84 62.87,29.84 v66.04,26.67 | v66.04,24.13 66.99,23.18 71.44,23.18 v72.39,22.23 | R35.2 77.47,53.98 | v75.88,53.98 77.15,53.98 R35.2
  Bottom 0.305: v66.04,26.67 v66.04,24.13 | v72.39,22.23 72.39,3.81 ARDUINO_NANO.D4 | v60.33,53.98 v75.88,53.98
RAW_RSSI1  (via drill 0.5 pad 1.02)
  Top 0.305: RECEIVER1.9 19.05,64.77
  Top 0.61: v27.94,38.1 27.94,41.91 33.66,47.62 33.66,55.24 35.56,57.15 35.56,59.69 v33.66,61.59 | RECEIVER1.9 19.05,63.5 21.59,60.96 27.3,60.96 v27.94,61.59 | v38.42,35.56 38.73,36.2 R1.1
  Bottom 0.61: v27.94,38.1 30.48,35.56 v38.42,35.56 | v27.94,61.59 v33.66,61.59
RAW_RSSI2  (via drill 0.5 pad 1.02)
  Top 0.61: R4.1 v40.64,53.34 | v51.75,53.34 52.07,53.98 v52.07,57.78 | v52.07,62.07 RECEIVER2.9
  Bottom 0.61: v40.64,53.34 v51.75,53.34 | v52.07,57.78 v52.07,62.07
RAW_RSSI3  (via drill 0.5 pad 1.02)
  Top 0.61: RECEIVER3.9 v85.09,52.07 | v78.11,43.18 v73.03,36.83 | v68.15,36.83 R12.1
  Bottom 0.61: v73.03,36.83 v68.15,36.83 | v78.11,43.18 78.11,45.09 v85.09,52.07
RSSI_1  (via drill 0.5 pad 1.02)
  Top 0.406: 32.44,37.1 C2.1
  Top 0.61: v35.56,34.29 R2.2 32.44,37.1
  Bottom 0.61: ARDUINO_NANO.A2 69.22,29.84 46.35,29.84 44.45,31.75 38.1,31.75 v35.56,34.29
RSSI_2
  Top 0.305: 45.45,51.8 45.72,52.07 C3.1 45.81,51.66
  Top 0.406: R5.2 45.45,51.8 | ARDUINO_NANO.A1 83.82,22.86 82.55,24.13 68.58,24.13 67.31,25.4 48.9,25.4 48.26,26.04 48.26,30.48 49.21,31.43 49.21,40.96 48.58,41.59 48.58,50.48 47.4,51.66 45.81,51.66 C3.1
RSSI_3
  Top 0.305: 63.5,36.6 R13.2 | C9.1
  Top 0.406: 63.5,36.6 63.5,35.56 66.04,33.02 69.85,33.02 77.47,25.4 83.82,25.4 86.36,22.86 ARDUINO_NANO.A0 | R13.2 61.64,37.1 C9.1
SWITCH_DOWN
  Top 0.305: ARDUINO_NANO.D12 93.98,3.81 91.44,6.35 53.34,6.35 51.44,8.26 48.9,8.26 46.99,6.35 39.32,6.35 S3.3
SWITCH_LEFT
  Bottom 0.305: S4.3 31.78,12.67 33.34,11.11 46.04,11.11 47.62,9.53 51.44,9.53 ARDUINO_NANO.D1/TX
SWITCH_RIGHT
  Bottom 0.305: ARDUINO_NANO.D0/RX 60.96,3.81 54.61,10.16 48.16,10.16 S2.3
SWITCH_UP  (via drill 0.5 pad 1.02)
  Top 0.305: S1.3 38.13,20.29 44.45,13.97 53.34,13.97 59.05,8.26 v73.66,8.26
  Bottom 0.305: ARDUINO_NANO.D7 81.28,6.35 79.38,8.26 v73.66,8.26
VBAT_SENSE
  Top 0.406: R9.2 R8.1 32.43,2.49 32.38,2.54 37.47,7.62 46.99,7.62 48.9,9.53 51.44,9.53 53.66,7.3 74.61,7.3 76.2,8.89 76.2,11.75 71.12,16.83 ARDUINO_NANO.A6
VIDEO_1  (via drill 0.5)
  Top 1.016: RECEIVER1.11 v24.13,62.23
  Bottom 0.61: PI5V331WE.10 PI5V331WE.6
  Bottom 0.813: PI5V331WE.6 40.01,76.83 40.64,76.2 40.64,69.85 39.37,68.58 25.4,68.58 24.13,67.31 v24.13,62.23
VIDEO_2  (via drill 0.5)
  Top 1.016: RECEIVER2.11 v57.15,62.23
  Bottom 0.61: PI5V331WE.11 PI5V331WE.5
  Bottom 0.813: v57.15,62.23 57.15,67.31 55.88,68.58 43.18,68.58 41.91,69.85 41.91,76.83 40.64,78.11 PI5V331WE.5 35.56,78.11
VIDEO_3  (via drill 0.5)
  Top 1.016: RECEIVER3.11 v90.17,62.23
  Bottom 0.61: PI5V331WE.12 PI5V331WE.4
  Bottom 0.813: v90.17,62.23 90.17,66.04 87.63,68.58 57.78,68.58 56.52,69.85 43.81,69.85 43.18,70.48 43.18,77.47 41.27,79.38 PI5V331WE.4
VIDEO_OUT1
  Top 0.813: 12.42,41.6 12.36,41.6 | 12.36,41.6 12.34,40.97 12.34,45.47 VIDEO1.T | 12.36,41.6 PAD1.1
  Bottom 0.813: PI5V331WE.7 39.05,75.56 39.37,75.25 39.37,70.48 38.73,69.85 13.34,69.85 6.99,63.5 6.99,60.96 12.7,55.24 12.7,46.52 VIDEO1.T
VIDEO_OUT2
  Top 0.813: VIDEO2.T 12.63,26.92 12.7,29.21 12.7,38.1 10.79,40.01 10.79,41.91 10.74,41.33 PAD2.1
  Bottom 0.813: PI5V331WE.9 12.06,74.3 4.45,66.67 4.45,59.05 8.26,55.24 8.26,30.83 VIDEO2.T

### Text on the board
tNames: Multipath | Goebish & | Triversity | La Fabrique Circulaire | Erazer | 150603 - Rev.1 | 2 | 1 | . | . | // | Nano 328 | USB
bNames: .